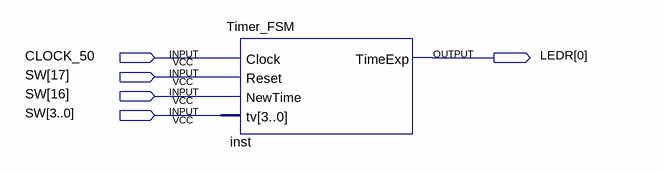
[diagram p0: schematic sheet]
// Quartus schematic Block4.bdf as structural Verilog: 1 symbols, 5 pins
module Block4 (
  input  CLOCK_50,
  input  [17:0] SW,
  output [0:0] LEDR
);

  Timer_FSM inst (.Clock(CLOCK_50), .Reset(SW[17]), .NewTime(SW[16]), .tv(SW[3:0]), .TimeExp(LEDR[0]));
endmodule
